# Altium schematic sheet LM2576_BuckConverter.SchDoc
size 129 x 100 mm
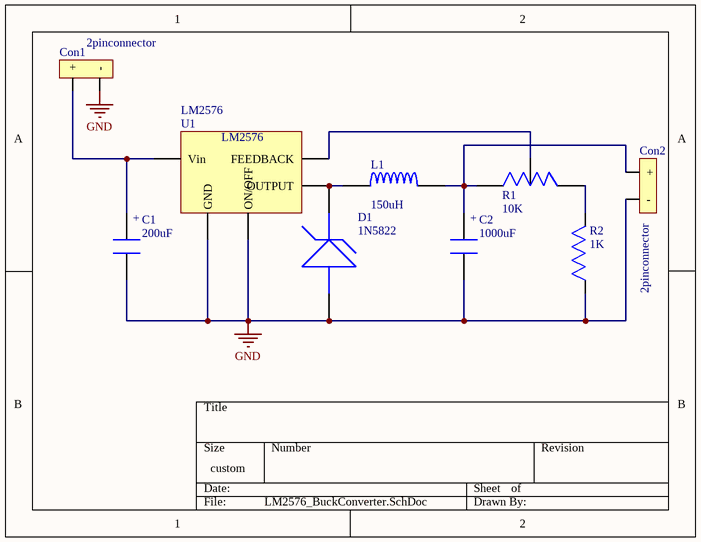
[diagram p0: LM2576_BuckConverter.SchDoc]

## Parts
C1  200uF  [220uF Capacitor]
C2  1000uF  [1000Uf Cap]
Con1  2pinconnector  [2pin]
Con2  2pinconnector  [2pin]
D1  1N5822  [1n5822]
L1  150uH  [150uH Inductor]
R1  10K  [10K Pot]
R2  1K  [1K 1206 Res]
U1  LM2576  [LM2576-TO63-5]

## Nets
GND: C1.2 C2.2 Con1.2(-) Con2.2(-) D1.2 R2.1 U1.3(GND) U1.5(ON/OFF)
NetC1_1: C1.1 Con1.1(+) U1.1(Vin)
NetC2_1: C2.1 Con2.1(+) L1.2 R1.1
NetD1_1: D1.1 L1.1 U1.2(OUTPUT)
NetR1_2: R1.2 U1.4(FEEDBACK)
NetR1_3: R1.3 R2.2

## Notes on the sheet
- (in symbol Electrolytic Cap) +
- (in symbol Electrolytic Cap 220uF) +

## Library data of the parts
C1 = Electrolytic Cap 220uF
C2 = Electrolytic Cap
L1 = 150uH L
R1 = Variable Resistor
R2 = Resistor